# Altium schematic sheet Fastino-DIOT.schdoc: Fastino
size 420 x 297 mm; EDA_Number: ARTIQ; Projet: Fastino; Author: G.Kasprowicz; CompanyName: WUT ISE; DrawnBy: G.Kasprowicz; Organization: WUT ISE; Address1: PW ISE; Address2: Nowowiejska 15/19 00-665 Warsaw; Address3: gkasprow@gmail.com; DocumentNumber: 1; SheetNumber: 1; SheetTotal: 12; ModifiedBy: -; CheckedDate: -; Title2: Top; DivGrp: WUT ISE; Designer: G.Kasprowicz; ModifiedDate: -; ProjectName: Sensor Box
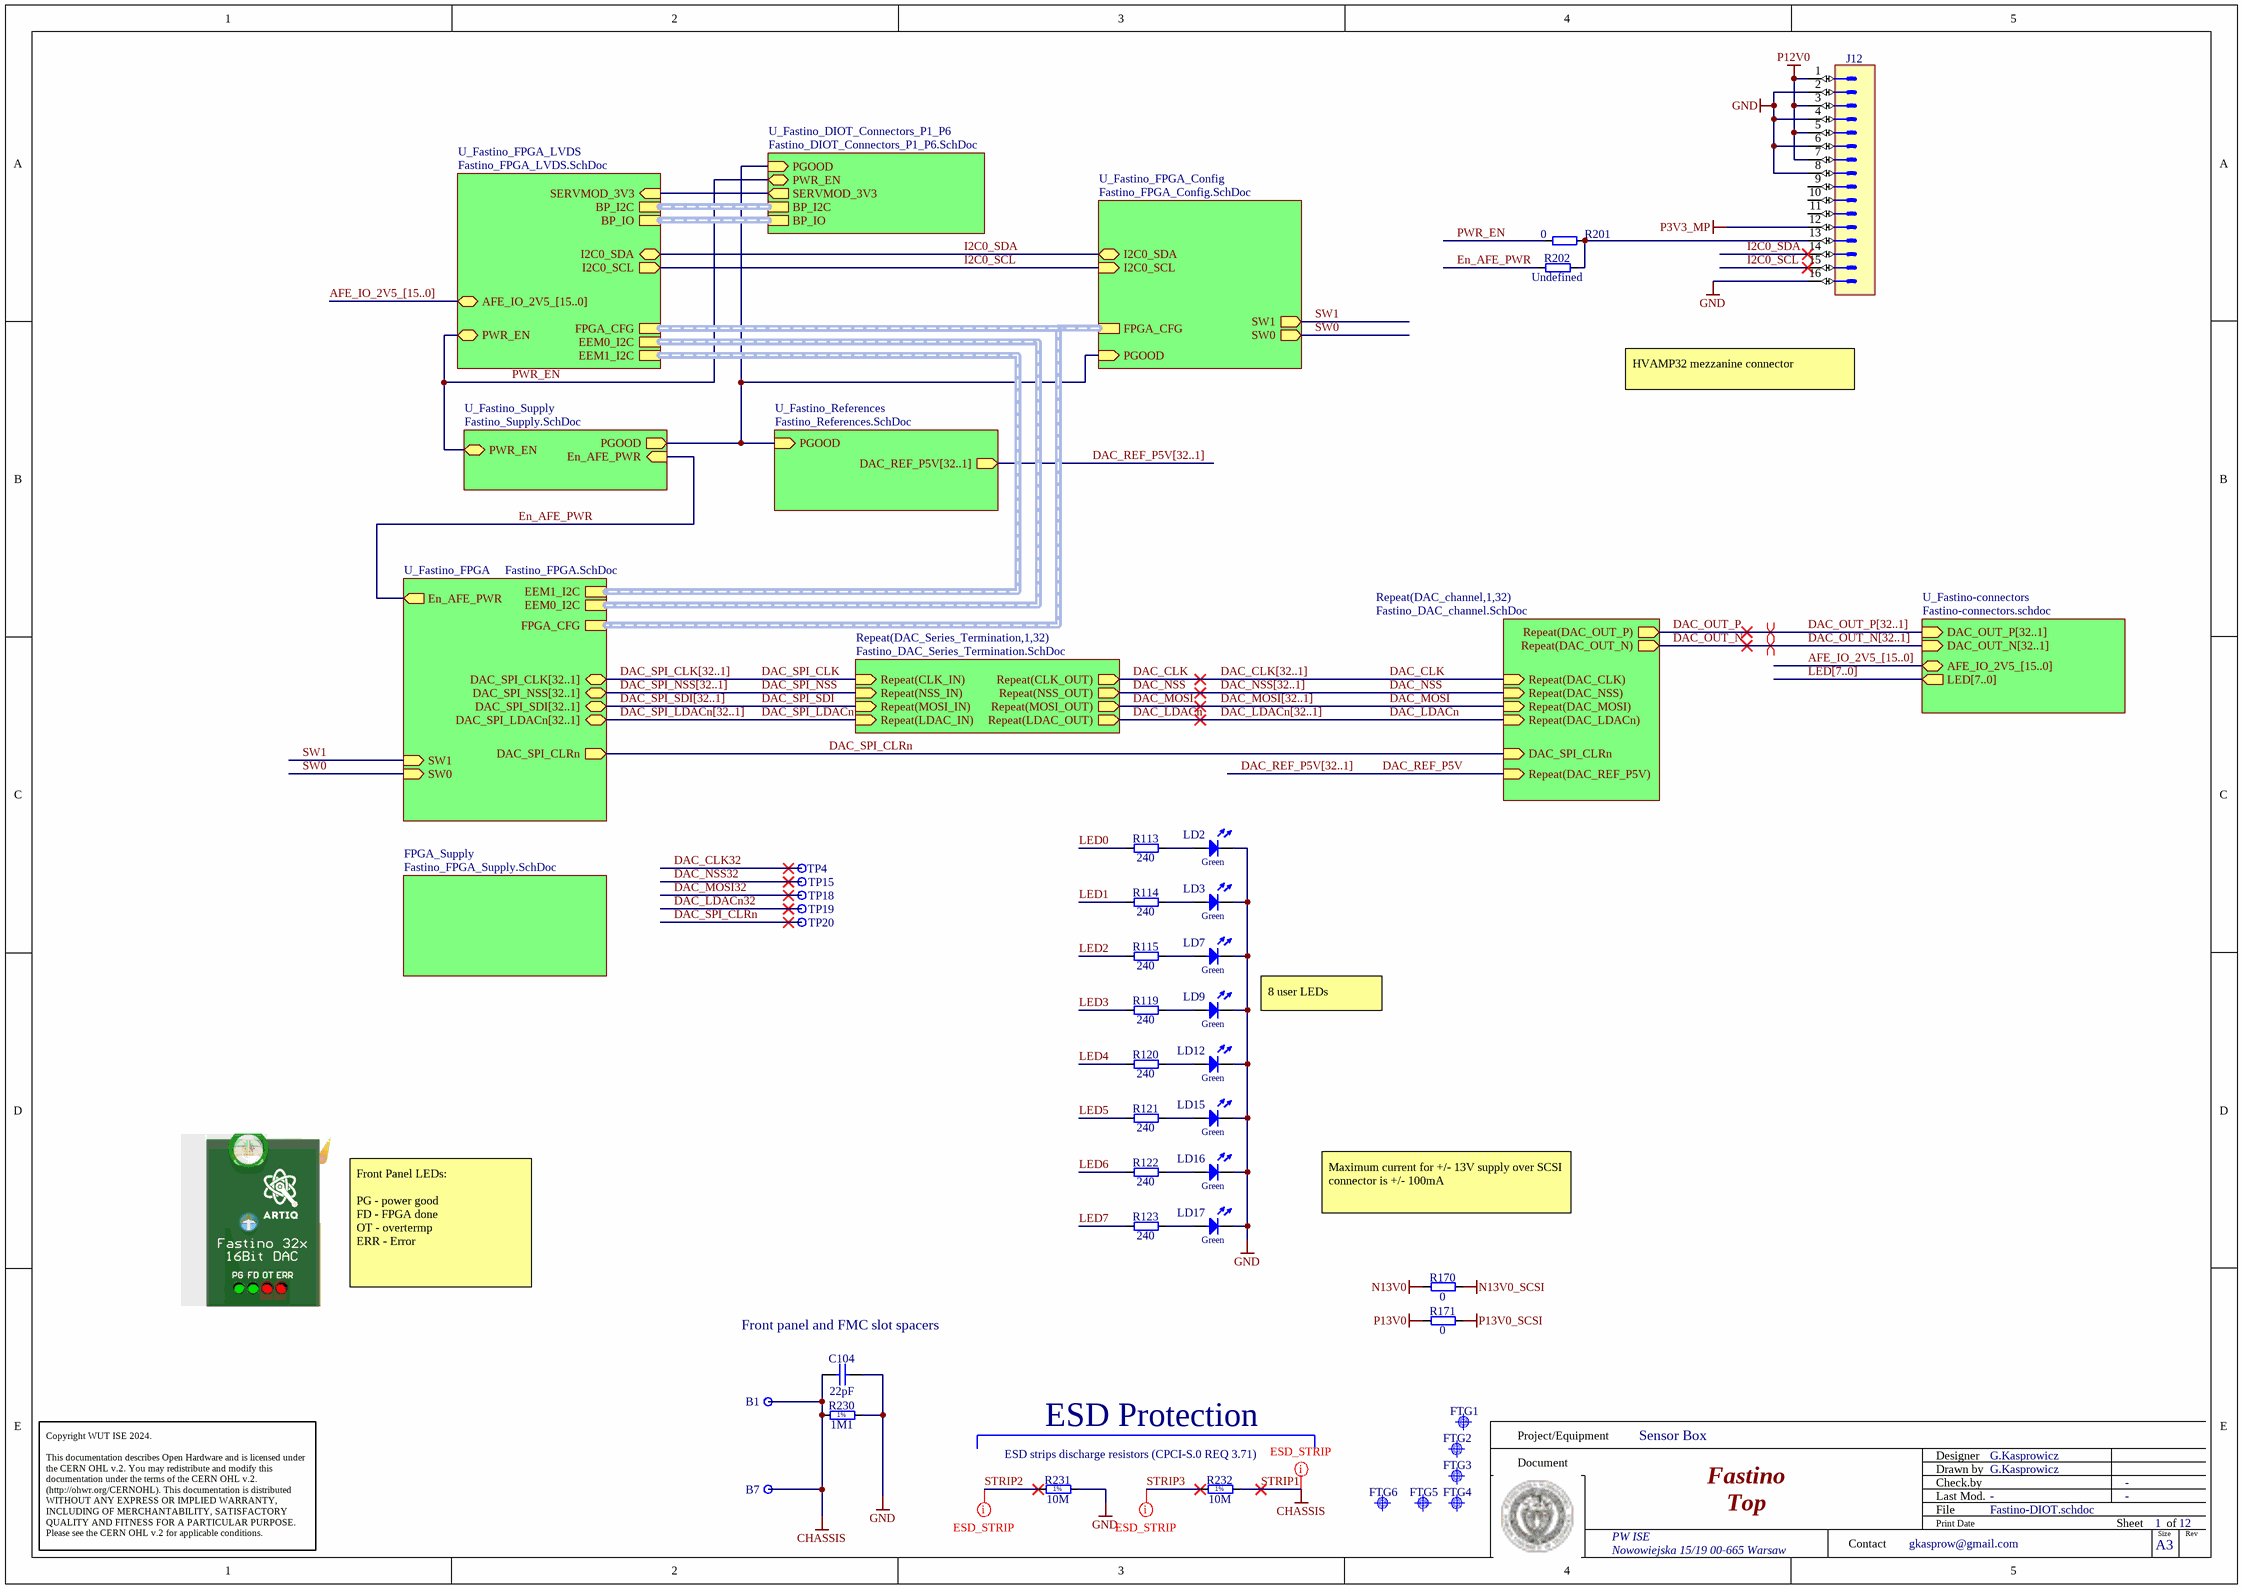
[diagram p0: Fastino-DIOT.schdoc]

## Parts
B1  Plated Hole  [MTG270_500]  (value not drawn)  (no BOM)
B7  Plated Hole  [MTG270_500]  (value not drawn)  (no BOM)
C104  22pF  [CAPC1005X55N]
FTG1  Use only in PCB  [FIDUCIAL_TOP_S100-200]  (value not drawn)
FTG2  Use only in PCB  [FIDUCIAL_TOP_S100-200]  (value not drawn)
FTG3  Use only in PCB  [FIDUCIAL_TOP_S100-200]  (value not drawn)
FTG4  Use only in PCB  [FIDUCIAL_TOP_S100-200]  (value not drawn)
FTG5  Use only in PCB  [FIDUCIAL_TOP_S100-200]  (value not drawn)
FTG6  Use only in PCB  [FIDUCIAL_TOP_S100-200]  (value not drawn)
J12  Header 16  [3M_N2516-6002RB]  (value not drawn)
LD2  Green  [LED_AVAGO_HSME-C120]
LD3  Green  [LED_AVAGO_HSME-C120]
LD7  Green  [LED_AVAGO_HSME-C120]
LD9  Green  [LED_AVAGO_HSME-C120]
LD12  Green  [LED_AVAGO_HSME-C120]
LD15  Green  [LED_AVAGO_HSME-C120]
LD16  Green  [LED_AVAGO_HSME-C120]
LD17  Green  [LED_AVAGO_HSME-C120]
R113  240  [RESC1005X40N]
R114  240  [RESC1005X40N]
R115  240  [RESC1005X40N]
R119  240  [RESC1005X40N]
R120  240  [RESC1005X40N]
R121  240  [RESC1005X40N]
R122  240  [RESC1005X40N]
R123  240  [RESC1005X40N]
R170  0  [RESC3216X65N]
R171  0  [RESC3216X65N]
R201  0  [RESC1005X40N]
R202  Undefined  [RESC1608X55N]
R230  1M1  [RESC2012X60N]
R231  10M  [RESC2113X55N]
R232  10M  [RESC2113X55N]
TP4  Test Point  [TPS127]  (value not drawn)  (no BOM)
TP15  Test Point  [TPS127]  (value not drawn)  (no BOM)
TP18  Test Point  [TPS127]  (value not drawn)  (no BOM)
TP19  Test Point  [TPS127]  (value not drawn)  (no BOM)
TP20  Test Point  [TPS127]  (value not drawn)  (no BOM)

## Sub-sheets
FPGA_Supply = Fastino_FPGA_Supply.SchDoc: no entries
Repeat(DAC_channel,1,32) = Fastino_DAC_channel.SchDoc: Repeat(DAC_OUT_P) (out), Repeat(DAC_OUT_N) (out), Repeat(DAC_CLK) (in), Repeat(DAC_NSS) (in), Repeat(DAC_MOSI) (in), DAC_SPI_CLRn (in), Repeat(DAC_LDACn) (in), Repeat(DAC_REF_P5V) (in)
Repeat(DAC_Series_Termination,1,32) = Fastino_DAC_Series_Termination.SchDoc: Repeat(CLK_IN) (in), Repeat(NSS_IN) (in), Repeat(MOSI_IN) (in), Repeat(LDAC_IN) (in), Repeat(CLK_OUT) (out), Repeat(NSS_OUT) (out), Repeat(LDAC_OUT) (out), Repeat(MOSI_OUT) (out)
U_Fastino-connectors = Fastino-connectors.schdoc: DAC_OUT_P[32..1] (in), DAC_OUT_N[32..1] (in), AFE_IO_2V5_[15..0] (bidir), LED[7..0] (out)
U_Fastino_DIOT_Connectors_P1_P6 = Fastino_DIOT_Connectors_P1_P6.SchDoc: PWR_EN (bidir), SERVMOD_3V3 (out), BP_I2C (harness I2C), BP_IO (harness EEM_LVDS), PGOOD (in)
U_Fastino_FPGA = Fastino_FPGA.SchDoc: DAC_SPI_LDACn[32..1] (bidir), DAC_SPI_SDI[32..1] (bidir), DAC_SPI_NSS[32..1] (bidir), DAC_SPI_CLRn (out), DAC_SPI_CLK[32..1] (bidir), FPGA_CFG (harness FPGA_CFG), SW1 (in), SW0 (in), EEM1_I2C (harness I2C), EEM0_I2C (harness I2C), En_AFE_PWR (out)
U_Fastino_FPGA_Config = Fastino_FPGA_Config.SchDoc: PGOOD (in), FPGA_CFG (harness FPGA_CFG), SW1 (out), SW0 (out), I2C0_SCL (in), I2C0_SDA (bidir)
U_Fastino_FPGA_LVDS = Fastino_FPGA_LVDS.SchDoc: EEM0_I2C (harness I2C), EEM1_I2C (harness I2C), PWR_EN (bidir), AFE_IO_2V5_[15..0] (bidir), I2C0_SDA (bidir), I2C0_SCL (out), BP_IO (harness EEM_LVDS), BP_I2C (harness I2C), SERVMOD_3V3 (in), FPGA_CFG (harness FPGA_CFG)
U_Fastino_References = Fastino_References.SchDoc: PGOOD (in), DAC_REF_P5V[32..1] (out)
U_Fastino_Supply = Fastino_Supply.SchDoc: PGOOD (out), PWR_EN (bidir), En_AFE_PWR (in)

## Nets
GND: C104.2 J12.2 J12.4 J12.6 J12.8 J12.16 LD2.1(C) LD3.1(C) LD7.1(C) LD9.1(C) LD12.1(C) LD15.1(C) LD16.1(C) LD17.1(C) R230.2 R231.2
N13V0: R170.1
N13V0_SCSI: R170.2
P3V3_MP: J12.12
P12V0: J12.1 J12.3 J12.5 J12.7
P13V0: R171.1
P13V0_SCSI: R171.2
STRIP1: B1.1 B7.1 C104.1 R230.1 R232.2  [also labelled CHASSIS]
DAC_CLK: sheet Repeat(DAC_channel,1,32)/Repeat(DAC_CLK), sheet Repeat(DAC_Series_Termination,1,32)/Repeat(CLK_OUT)
DAC_CLK32: TP4.1
DAC_LDACn: sheet Repeat(DAC_channel,1,32)/Repeat(DAC_LDACn), sheet Repeat(DAC_Series_Termination,1,32)/Repeat(LDAC_OUT)
DAC_LDACn32: TP19.1
DAC_MOSI: sheet Repeat(DAC_channel,1,32)/Repeat(DAC_MOSI), sheet Repeat(DAC_Series_Termination,1,32)/Repeat(MOSI_OUT)
DAC_MOSI32: TP18.1
DAC_NSS: sheet Repeat(DAC_channel,1,32)/Repeat(DAC_NSS), sheet Repeat(DAC_Series_Termination,1,32)/Repeat(NSS_OUT)
DAC_NSS32: TP15.1
DAC_OUT_N: sheet Repeat(DAC_channel,1,32)/Repeat(DAC_OUT_N)
DAC_OUT_P: sheet Repeat(DAC_channel,1,32)/Repeat(DAC_OUT_P)
DAC_REF_P5V: sheet Repeat(DAC_channel,1,32)/Repeat(DAC_REF_P5V)
DAC_SPI_CLK: sheet Repeat(DAC_Series_Termination,1,32)/Repeat(CLK_IN)
DAC_SPI_CLRn: TP20.1 ; sheet Repeat(DAC_channel,1,32)/DAC_SPI_CLRn, sheet U_Fastino_FPGA/DAC_SPI_CLRn
DAC_SPI_LDACn: sheet Repeat(DAC_Series_Termination,1,32)/Repeat(LDAC_IN)
DAC_SPI_NSS: sheet Repeat(DAC_Series_Termination,1,32)/Repeat(NSS_IN)
DAC_SPI_SDI: sheet Repeat(DAC_Series_Termination,1,32)/Repeat(MOSI_IN)
En_AFE_PWR: R202.1 ; sheet U_Fastino_FPGA/En_AFE_PWR, sheet U_Fastino_Supply/En_AFE_PWR
I2C0_SCL: J12.15 ; sheet U_Fastino_FPGA_Config/I2C0_SCL, sheet U_Fastino_FPGA_LVDS/I2C0_SCL
I2C0_SDA: J12.14 ; sheet U_Fastino_FPGA_Config/I2C0_SDA, sheet U_Fastino_FPGA_LVDS/I2C0_SDA
LED0: R113.1
LED1: R114.1
LED2: R115.1
LED3: R119.1
LED4: R120.1
LED5: R121.1
LED6: R122.1
LED7: R123.1
PWR_EN: R201.2 ; sheet U_Fastino_FPGA_LVDS/PWR_EN, sheet U_Fastino_Supply/PWR_EN, sheet U_Fastino_DIOT_Connectors_P1_P6/PWR_EN
STRIP2: R231.1
STRIP3: R232.1
SW0: sheet U_Fastino_FPGA/SW0, sheet U_Fastino_FPGA_Config/SW0
SW1: sheet U_Fastino_FPGA/SW1, sheet U_Fastino_FPGA_Config/SW1
NetJ12_13: J12.13 R201.1 R202.2
NetLD2_2: LD2.2(A) R113.2
NetLD3_2: LD3.2(A) R114.2
NetLD7_2: LD7.2(A) R115.2
NetLD9_2: LD9.2(A) R119.2
NetLD12_2: LD12.2(A) R120.2
NetLD15_2: LD15.2(A) R121.2
NetLD16_2: LD16.2(A) R122.2
NetLD17_2: LD17.2(A) R123.2
(unnamed): sheet U_Fastino_FPGA_Config/PGOOD, sheet U_Fastino_References/PGOOD, sheet U_Fastino_Supply/PGOOD, sheet U_Fastino_DIOT_Connectors_P1_P6/PGOOD
(unnamed): sheet U_Fastino_FPGA_LVDS/SERVMOD_3V3, sheet U_Fastino_DIOT_Connectors_P1_P6/SERVMOD_3V3

Not connected (* = marked no-connect by the designer): J12 9 10 11

## Buses and harness runs
bus AFE_IO_2V5_[15..0] = sheet U_Fastino-connectors/AFE_IO_2V5_[15..0]
bus AFE_IO_2V5_[15..0] = sheet U_Fastino_FPGA_LVDS/AFE_IO_2V5_[15..0]
bus DAC_CLK[32..1]
bus DAC_LDACn[32..1]
bus DAC_MOSI[32..1]
bus DAC_NSS[32..1]
bus DAC_OUT_N[32..1] = sheet U_Fastino-connectors/DAC_OUT_N[32..1]
bus DAC_OUT_P[32..1] = sheet U_Fastino-connectors/DAC_OUT_P[32..1]
bus DAC_REF_P5V[32..1]
bus DAC_REF_P5V[32..1] = sheet U_Fastino_References/DAC_REF_P5V[32..1]
bus DAC_SPI_CLK[32..1] = sheet U_Fastino_FPGA/DAC_SPI_CLK[32..1]
bus DAC_SPI_LDACn[32..1] = sheet U_Fastino_FPGA/DAC_SPI_LDACn[32..1]
bus DAC_SPI_NSS[32..1] = sheet U_Fastino_FPGA/DAC_SPI_NSS[32..1]
bus DAC_SPI_SDI[32..1] = sheet U_Fastino_FPGA/DAC_SPI_SDI[32..1]
bus LED[7..0] = sheet U_Fastino-connectors/LED[7..0]
harness sheet U_Fastino_DIOT_Connectors_P1_P6/BP_I2C = sheet U_Fastino_FPGA_LVDS/BP_I2C
harness sheet U_Fastino_DIOT_Connectors_P1_P6/BP_IO = sheet U_Fastino_FPGA_LVDS/BP_IO
harness sheet U_Fastino_FPGA/EEM0_I2C = sheet U_Fastino_FPGA_LVDS/EEM0_I2C
harness sheet U_Fastino_FPGA/EEM1_I2C = sheet U_Fastino_FPGA_LVDS/EEM1_I2C
harness sheet U_Fastino_FPGA/FPGA_CFG = sheet U_Fastino_FPGA_Config/FPGA_CFG = sheet U_Fastino_FPGA_LVDS/FPGA_CFG

## Layout directives
differential pair: DAC_OUT_N, DAC_OUT_P
net class ESD_STRIP: STRIP1, STRIP2, STRIP3

## Notes on the sheet
- HVAMP32 mezzanine connector
- 8 user LEDs
- Maximum current for +/- 13V supply over SCSI connector is +/- 100mA
- Front Panel LEDs:
  PG - power good
  FD - FPGA done
  OT - overtermp
  ERR - Error
- (near C104) Front panel and FMC slot spacers
- ESD strips discharge resistors (CPCI-S.0 REQ 3.71)
- ESD Protection
- Project/Equipment
- Document
- Designer
- Drawn by
- Check.by
- Copyright WUT ISE 2024.
  This documentation describes Open Hardware and is licensed under the CERN OHL v.2. You may redistribute and modify this documentation under the terms of the CERN OHL v.2. (http://ohwr.org/CERNOHL). This documentation is distributed WITHOUT ANY EXPRESS OR IMPLIED WARRANTY, INCLUDING OF MERCHANTABILITY, SATISFACTORY QUALITY AND FITNESS FOR A PARTICULAR PURPOSE. Please see the CERN OHL v.2 for applicable conditions.
- Contact
- File
- Last Mod.
- Print Date
- Sheet
- Size
- A3
- of
- Rev
- (in symbol R0805_1M1_1%_0.125W_100PPM) 1%
- (in symbol R0805_10M_1%_0.125W_100PPM_VISHAY_CRCW e3) 1%

## Library data of the parts
B1 B7 = PLATED_HOLE2.7_PAD5.0: Single Terminal Socket; Part Description: Plated Through Hole: Hole Dia.=2.7mm Pad Dia.=5.0mm; Mounted: No; Part Number: PLATED_HOLE2.7_PAD5.0; Component Type: Standard (No BOM); Pin Count: 1; Family: Plated Hole; Socket: No; SMD: No; Sense: No; Status: None; ComponentHeight: 0mm; HelpURL: Undefined; Author: CERN DEM JMW; CreateDate: 27.09.2011; LatestRevisionDate: 27.09.2011; PackageDescription: Plated Through Hole: Hole Dia.=2.7mm Pad Dia.=5.0mm
C104 = CC0402_22PF_50V_5%_C0G: Non-polarised capacitor; Part Description: SMD Multilayer Chip Ceramic Capacitor; Manufacturer: GENERIC; Manufacturer1 Part Number: C0402C220J5GACTU; Voltage: 50V; TC: C0G/NP0; Tolerance: ±5%; Part Number: CC0402_22PF_50V_5%_C0G; Component Kind: Standard; Component Type: Standard; Pin Count: 2; Value: 22pF; Status: Preferred; Manufacturer Part Number: CC0402_22PF_50V_5%_C0G; Case: 0402; Mounted: Yes; Socket: No; SMD: Yes; Manufacturer1 Example: KEMET; Manufacturer1 ComponentHeight: 0.55mm; HelpURL: \\cern.ch\dfs\Applications\Altium\Datasheets\CC0402_C0G_KEMET_(Commercial Grade).pdf; Author: CERN DEM JLC; CreateDate: 2007-12-03; LatestRevisionDate: 2007-12-03; Sense: No
FTG1-FTG6 = FIDUCIAL_TARGET_S100-200: Fiducial Target; Part Description: Square Fiducial Target, Top Layer, 1.0mm, Top Solder 2.0mm, Keepout =2.0mm; Mounted: No; Part Number: FIDUCIAL_TARGET_S100-200; Component Kind: Standard (No BOM); Component Type: Standard (No BOM); Pin Count: 1; Family: Fiducial; Socket: No; SMD: Yes; Sense: No; Status: None; ComponentHeight: 0mm; HelpURL: Undefined; Author: CERN DEM JLC; CreateDate: 09.02.2010; LatestRevisionDate: 04.04.2012; PackageDescription: Square Fiducial Target, Top Layer, 1.0mm, Top Solder 2.0mm, Keepout =2.0mm
J12 = 3M_N2516-6002RB: Connector 16 Male; Part Description: 16 Contacts, Straight .100'' x .100'' Low Profile Four-Wall Header, (Solder Tail 2.84mm), 2500 Series; Manufacturer: 3M; PressFit: No; Part Number: 3M_N2516-6002RB; Component Kind: Standard; Component Type: Standard; Pin Count: 16; Family: Header 16; Mounted: Yes; Socket: No; SMD: No; Sense: No; Status: None; Manufacturer Part Number: N2516-6002RB; ComponentHeight: 10.03mm; HelpURL: \\cern.ch\dfs\Applications\Altium\Datasheets\3M_N2516-6002RB.pdf; Author: CERN DEM JLC; CreateDate: 11.02.2009; LatestRevisionDate: 27.10.2022
LD2 LD3 LD7 LD9 LD12 LD15-LD17 = LED_AVAGO_HSME-C120: LED Green 1C 2A; Part Description: High Performance Right Angle Chip Green LED; Manufacturer: AVAGO TECHNOLOGIES; PressFit: No; Bonding: No; Part Number: LED_AVAGO_HSME-C120; Component Kind: Standard; Component Type: Standard; Color: Green; PackageDescription: Green Chip LED, 2-Leads, Body 1.7x1.1mm, Side Emitting Package; Manufacturer Part Number: HSME-C120; Pin Count: 2; Mounted: Yes; Socket: No; SMD: Yes; Sense: No; ComponentHeight: 0.7mm; HelpURL: \\cern.ch\dfs\Applications\Altium\Datasheets\LED_AVAGO_HSME-C120.pdf; ComponentLink1URL: \\cern.ch\dfs\Applications\Altium\Datasheets\LED_AVAGO_HSME-C110_DESIGN-GUIDE.pdf; ComponentLink1Description: Design Guide; Author: CERN DEM JMW; CreateDate: 22.07.2009; LatestRevisionDate: 20.06.2012
R113-R115 R119-R123 = R0402_240R_1%_0.0625W_100PPM: Resistor - 1%; Part Description: General Purpose Thick Film Chip Resistor; Manufacturer: GENERIC; Manufacturer1 Part Number: 232270672401L; TC: ±100ppm/°C; PressFit: No; Part Number: R0402_240R_1%_0.0625W_100PPM; Component Kind: Standard; Component Type: Standard; Pin Count: 2; Value: 240; Status: Not Recommended; Power: 0.0625W; Tolerance: ±1%; Manufacturer Part Number: R0402_240R_1%_0.0625W_100PPM; Case: 0402; Mounted: Yes; Sense: No; Socket: No; SMD: Yes; Manufacturer1 Example: YAGEO PHYCOMP; Manufacturer1 ComponentHeight: 0.4mm; HelpURL: \\cern.ch\dfs\Applications\Altium\Datasheets\R0402_Phycomp_RC0402.pdf; Author: CERN DEM JLC; CreateDate: 03.12.2007; LatestRevisionDate: 17.10.2012
R170 R171 = R1206_0R_Jumper: Resistor; Part Description: 2A (0.05R Max DC Resistance) Zero Ohm Jumper; Manufacturer: GENERIC; Manufacturer1 Part Number: NRC12Z0; PressFit: No; Part Number: R1206_0R_JUMPER; Component Kind: Standard; Component Type: Standard; Pin Count: 2; Value: 0; Status: Preferred; Manufacturer Part Number: R1206_0R_JUMPER; Case: 1206; Mounted: Yes; Sense: No; Socket: No; SMD: Yes; Manufacturer1 Example: NIC COMPONENT; Manufacturer1 ComponentHeight: 0.65mm; HelpURL: \\cern.ch\dfs\Applications\Altium\Datasheets\R1206_NIC_NRC.pdf; Author: CERN DEM JLC; CreateDate: 03.12.2007; LatestRevisionDate: 13.03.2008
R201 = R0402_0R_JUMPER: Resistor; Part Description: 1A (0.05R Max DC Resistance) Zero Ohm Jumper; Manufacturer: GENERIC; Manufacturer1 Part Number: 232270591001L; PressFit: No; Part Number: R0402_0R_JUMPER; Component Kind: Standard; Component Type: Standard; Pin Count: 2; Value: 0; Status: Not Recommended; Manufacturer Part Number: R0402_0R_JUMPER; Case: 0402; Mounted: Yes; Socket: No; SMD: Yes; Manufacturer1 Example: YAGEO PHYCOMP; Manufacturer1 ComponentHeight: 0.4mm; HelpURL: \\cern.ch\dfs\Applications\Altium\Datasheets\R0402_Phycomp_RC0402.pdf; Author: CERN DEM JLC; CreateDate: 03.12.2007; LatestRevisionDate: 17.10.2012; Sense: No
R202 = R0603_NO-VALUE: Resistor; Part Description: Reserved Footprint For a 0603 (1608) Chip Resistor; PressFit: No; Mounted: No; Part Number: R0603_NO-VALUE; Component Kind: Standard; Component Type: Standard; Pin Count: 2; Value: Undefined; Status: None; Manufacturer: Undefined; Manufacturer Part Number: R0603_NO-VALUE; Case: 0603; Sense: No; Socket: No; SMD: Yes; Manufacturer1 Example: Undefined; Manufacturer1 Part Number: Undefined; Manufacturer1 ComponentHeight: Undefined; HelpURL: Undefined; Author: CERN DEM JLC; CreateDate: 03.12.2007; LatestRevisionDate: 13.03.2008
R230 = R0805_1M1_1%_0.125W_100PPM: Resistor - 1%; Part Description: General Purpose Thick Film Chip Resistor; Manufacturer: GENERIC; Manufacturer1 Part Number: NRC10F1104TRF; Power: 0.125W; TC: ±100ppm/°C; PressFit: No; Part Number: R0805_1M1_1%_0.125W_100PPM; Component Kind: Standard; Component Type: Standard; Pin Count: 2; Value: 1M1; Status: Preferred; Tolerance: ±1%; Manufacturer Part Number: R0805_1M1_1%_0.125W_100PPM; Case: 0805; Mounted: Yes; Sense: No; Socket: No; SMD: Yes; Manufacturer1 Example: NIC COMPONENT; Manufacturer1 ComponentHeight: 0.6mm; HelpURL: \\cern.ch\dfs\Applications\Altium\Datasheets\R0805_NIC_NRC.pdf; Author: CERN DEM JLC; CreateDate: 03/12/2007; LatestRevisionDate: 13/03/2008
R231 R232 = R0805_10M_1%_0.125W_100PPM_VISHAY_CRCW e3: Resistor - 1%; Part Description: 150V, Standard Thick Film Chip Resistor; Manufacturer: VISHAY DALE; Manufacturer Part Number: CRCW080510M0FKEA; Power: 0.125W; TC: ±100ppm/°C; PressFit: No; Part Number: R0805_10M_1%_0.125W_100PPM_VISHAY_CRCW e3; Component Kind: Standard; Component Type: Standard; Pin Count: 2; Value: 10M; Status: None; Tolerance: ±1%; Case: 0805; Mounted: Yes; Sense: No; Socket: No; SMD: Yes; ComponentHeight: 0.5mm; HelpURL: \\cern.ch\dfs\Applications\Altium\Datasheets\R0805_VISHAY_CRCW e3.pdf; Author: CERN DEM BC; CreateDate: 2019-11-12; LatestRevisionDate: 2019-11-12
TP4 TP15 TP18-TP20 = SMD_PAD_1.27X1.27MM: Part Description: 1.27mm x 1.27mm PCB Copper Area (SMD Test Point); Mounted: No; Part Number: SMD_PAD_1.27X1.27MM; Component Type: Standard (No BOM); Pin Count: 1; Family: Test Point; Socket: No; SMD: No; Sense: No; Status: None; ComponentHeight: 0mm; HelpURL: Undefined; Author: CERN DEM JLC; CreateDate: 12.01.2008; LatestRevisionDate: 12.01.2008; PackageDescription: 1.27mm x 1.27mm PCB Copper Area (SMD Test Point)